# Altium schematic sheet TC364_MainBoard_Singal_V1.0.SchDoc
size A4
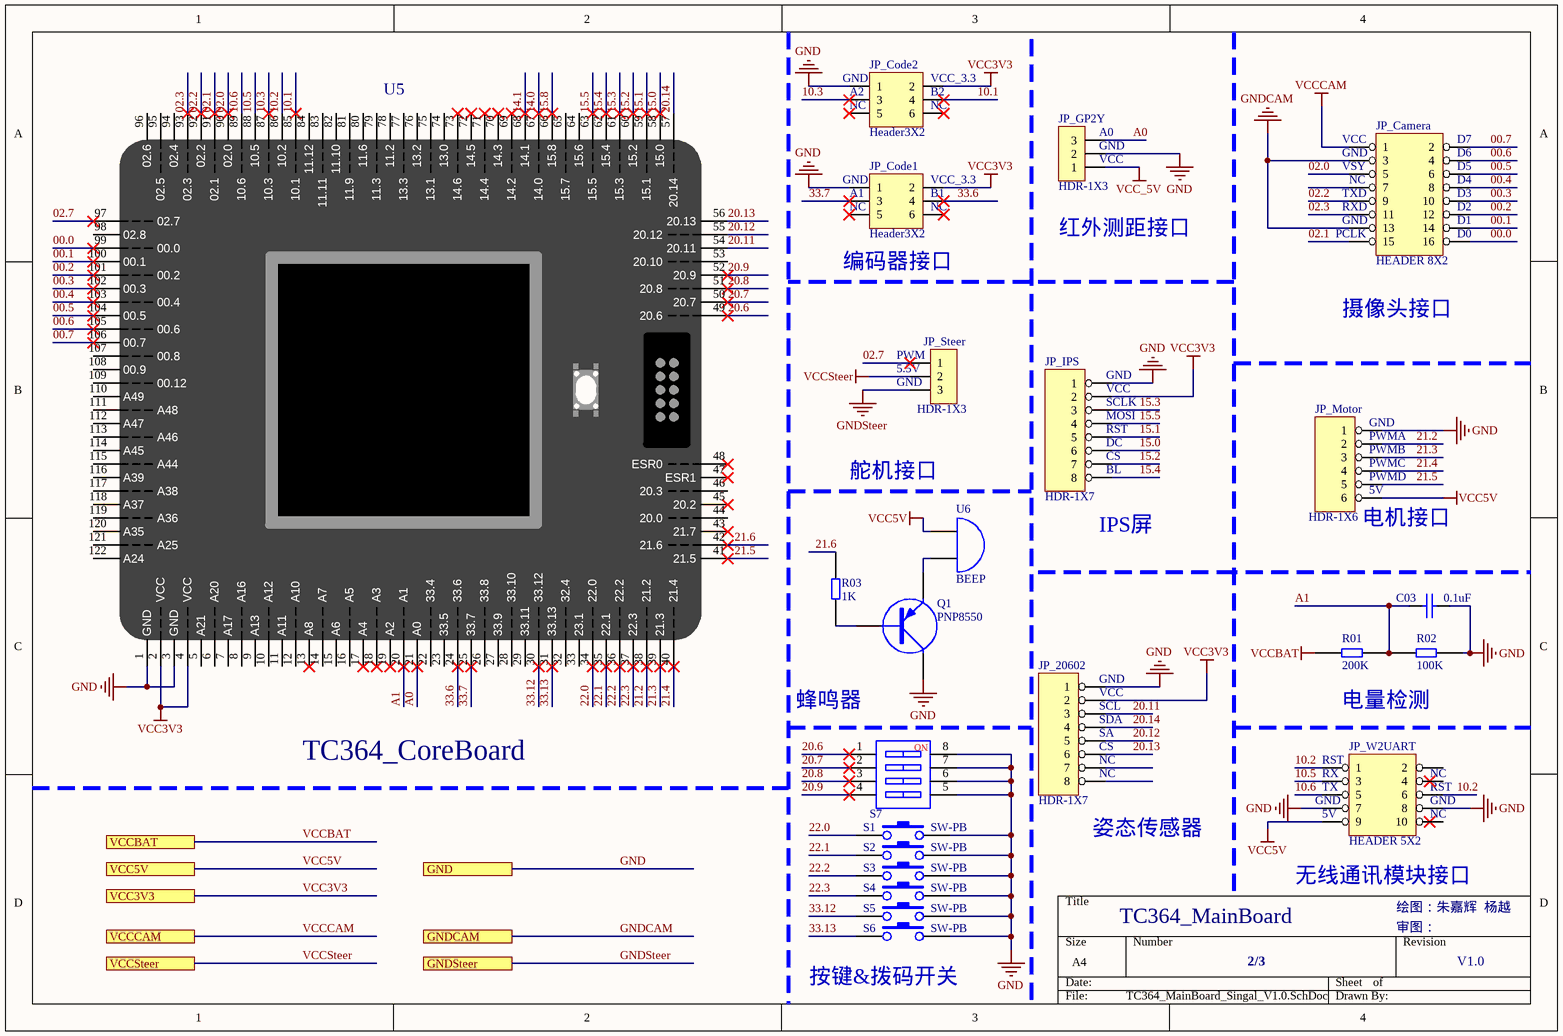
[diagram p0: TC364_MainBoard_Singal_V1.0.SchDoc]

## Parts
C03  0.1uF  [0805_C]
JP_20602  HDR-1X7  [SIP8]
JP_Camera  HEADER 8X2  [IDC16-JLC - duplicate]
JP_Code1  Header3X2  [HDR2.54-LI-2x3P]
JP_Code2  Header3X2  [HDR2.54-LI-2x3P]
JP_GP2Y  HDR-1X3  [HDR2.54-LI-3P]
JP_IPS  HDR-1X7  [SIP8]
JP_Motor  HDR-1X6  [SIP6N]
JP_Steer  HDR-1X3  [HDR2.54-LI-3P]
JP_W2UART  HEADER 5X2  [IDC10-JLC]
Q1  PNP8550  [PNP8550-SO]
R01  200K  [0805_R]
R02  100K  [0805_R]
R03  1K  [0805_R]
S1  SW-PB  [KEY2-6X3]
S2  SW-PB  [KEY2-6X3]
S3  SW-PB  [KEY2-6X3]
S4  SW-PB  [KEY2-6X3]
S5  SW-PB  [KEY2-6X3]
S6  SW-PB  [KEY2-6X3]
S7  SW-4P  [CSW DIP-4P]  (value not drawn)
U5  TC364_CoreBoard  [TC364_CoreBoard]
U6  BEEP  [BUZ]

## Ports
GND, GNDCAM, GNDSteer, VCC3V3, VCC5V, VCCBAT, VCCCAM, VCCSteer

## Nets
GND: C03.2 JP_20602.1 JP_Code1.1 JP_Code2.1 JP_GP2Y.2 JP_IPS.1 JP_Motor.1 JP_W2UART.7 JP_W2UART.8 Q1.3(C) R02.1 S1.2 S2.2 S3.2 S4.2 S5.2 S6.2 S7.5 S7.6 S7.7 S7.8 U5.1(GND) U5.3(GND) ; port GND
GNDCAM: JP_Camera.3 JP_Camera.13 ; port GNDCAM
GNDSteer: JP_Steer.3 ; port GNDSteer
VCC3V3: JP_20602.2 JP_Code1.2 JP_Code2.2 JP_IPS.2 U5.2(VCC) U5.4(VCC) ; port VCC3V3
VCC5V: JP_Motor.6 JP_W2UART.9 U6.1(A) ; port VCC5V
VCC_5V: JP_GP2Y.1
VCCBAT: R01.2 ; port VCCBAT
VCCCAM: JP_Camera.1 ; port VCCCAM
VCCSteer: JP_Steer.2 ; port VCCSteer
00.0: JP_Camera.16 U5.99(00.0)
00.1: JP_Camera.14 U5.100(00.1)
00.2: JP_Camera.12 U5.101(00.2)
00.3: JP_Camera.10 U5.102(00.3)
00.4: JP_Camera.8 U5.103(00.4)
00.5: JP_Camera.6 U5.104(00.5)
00.6: JP_Camera.4 U5.105(00.6)
00.7: JP_Camera.2 U5.106(00.7)
02.0: JP_Camera.5 U5.90(02.0)
02.1: JP_Camera.15 U5.91(02.1)
02.2: JP_Camera.9 U5.92(02.2)
02.3: JP_Camera.11 U5.93(02.3)
02.7: JP_Steer.1 U5.97(02.7)
10.1: JP_Code2.4 U5.85(10.1)
10.2: JP_W2UART.1 JP_W2UART.6 U5.86(10.2)
10.3: JP_Code2.3 U5.87(10.3)
10.5: JP_W2UART.3 U5.88(10.5)
10.6: JP_W2UART.5 U5.89(10.6)
14.0: U5.67(14.0)
14.1: U5.68(14.1)
15.0: JP_IPS.6 U5.58(15.0)
15.1: JP_IPS.5 U5.59(15.1)
15.2: JP_IPS.7 U5.60(15.2)
15.3: JP_IPS.3 U5.61(15.3)
15.4: JP_IPS.8 U5.62(15.4)
15.5: JP_IPS.4 U5.63(15.5)
15.8: U5.66(15.8)
20.6: S7.1 U5.49(20.6)
20.7: S7.2 U5.50(20.7)
20.8: S7.3 U5.51(20.8)
20.9: S7.4 U5.52(20.9)
20.11: JP_20602.3 U5.54(20.11)
20.12: JP_20602.5 U5.55(20.12)
20.13: JP_20602.6 U5.56(20.13)
20.14: JP_20602.4 U5.57(20.14)
21.2: JP_Motor.2 U5.38(21.2)
21.3: JP_Motor.3 U5.39(21.3)
21.4: JP_Motor.4 U5.40(21.4)
21.5: JP_Motor.5 U5.41(21.5)
21.6: R03.1 U5.42(21.6)
22.0: S1.1 U5.34(22.0)
22.1: S2.1 U5.35(22.1)
22.2: S3.1 U5.36(22.2)
22.3: S4.1 U5.37(22.3)
33.6: JP_Code1.4 U5.24(33.6)
33.7: JP_Code1.3 U5.25(33.7)
33.12: S5.1 U5.30(33.12)
33.13: S6.1 U5.31(33.13)
A0: JP_GP2Y.3 U5.21(A0)
A1: C03.1 R01.1 R02.2 U5.20(A1)
NetQ1_1: Q1.1(B) R03.2
NetQ1_2: Q1.2(E) U6.2(B)

Not connected (* = marked no-connect by the designer): JP_20602 7 8; JP_Camera 7; JP_Code1 5* 6*; JP_Code2 5* 6*; JP_W2UART 2 4 10; U5 5(A21) 6(A20) 7(A17) 8(A16) 9(A13) 10(A12) 11(A11) 12(A10) 13(A8)* 14(A7) 15(A6) 16(A5) 17(A4)* 18(A3)* 19(A2)* 22(33.4) 23(33.5) 26(33.8) 27(33.9) 28(33.10) 29(33.11) 32(32.4) 33(23.1) 43(21.7)* 44(20.0) 45(20.2)* 46(20.3) 47(ESR1)* 48(ESR0)* 53(20.10) 64(15.6) 65(15.7) 69(14.2)* 70(14.3)* 71(14.4)* 72(14.5)* 73(14.6)* 74(13.0) 75(13.1) 76(13.2) 77(13.3) 78(11.2) 79(11.3) 80(11.6) 81(11.9) 82(11.10) 83(11.11) 84(11.12) 94(02.4) 95(02.5) 96(02.6) 98(02.8) 107(00.8) 108(00.9) 109(00.12) 110(A49) 111(A48) 112(A47) 113(A46) 114(A45) 115(A44) 116(A39) 117(A38) 118(A37) 119(A36) 120(A35) 121(A25) 122(A24)

## Notes on the sheet
- (near JP_Code2) GND
- (near JP_Code2) A2
- (near JP_Code2) NC
- (near JP_Code2) B2
- (near JP_Code2) VCC_3.3
- (near JP_GP2Y) A0
- (near JP_GP2Y) GND
- (near JP_GP2Y) VCC
- (near JP_Camera) GND
- (near JP_Camera) VSY
- (near JP_Camera) VCC
- (near JP_Camera) D5
- (near JP_Camera) D6
- (near JP_Camera) D7
- (near JP_Code1) GND
- (near JP_Code1) A1
- (near JP_Code1) NC
- (near JP_Code1) B1
- (near JP_Code1) VCC_3.3
- (near JP_GP2Y) 红外测距接口
- (near JP_Camera) PCLK
- (near JP_Camera) TXD
- (near JP_Camera) RXD
- (near JP_Camera) NC
- (near JP_Camera) D0
- (near JP_Camera) D1
- (near JP_Camera) D2
- (near JP_Camera) D3
- (near JP_Camera) D4
- (near JP_Code1) 编码器接口
- (near JP_Steer) PWM
- (near JP_Steer) GND
- (near JP_Steer) 5.5V
- (near JP_IPS) GND
- 摄像头接口
- (near JP_IPS) VCC
- (near JP_IPS) SCLK
- (near JP_IPS) MOSI
- (near JP_IPS) RST
- (near JP_IPS) DC
- (near JP_Motor) GND
- (near JP_Motor) PWMA
- 舵机接口
- (near JP_IPS) CS
- (near JP_IPS) BL
- (near JP_Motor) 5V
- (near JP_Motor) PWMB
- (near JP_Motor) PWMC
- (near JP_Motor) PWMD
- (near JP_IPS) IPS屏
- (near JP_Motor) 电机接口
- 蜂鸣器
- (near JP_20602) VCC
- (near JP_20602) SCL
- (near JP_20602) GND
- 电量检测
- (near JP_20602) SDA
- (near JP_20602) SA
- (near JP_20602) NC
- (near JP_20602) CS
- (near JP_W2UART) TX
- (near JP_W2UART) RX
- (near JP_W2UART) RST
- (near JP_W2UART) NC
- (near JP_20602) 姿态传感器
- (near JP_W2UART) GND
- (near JP_W2UART) 5V
- TC364_MainBoard
- (near JP_W2UART) 无线通讯模块接口
- 绘图：朱嘉辉  杨越
- (near S6) 按键&拨码开关
- 2/3
- 审图：
- V1.0
- (in symbol SW-4P) NO

## Library data of the parts
C03 = CAP: Capacitor
JP_20602 JP_IPS = HEADER 8: 8 Pin Header
JP_Code1 JP_Code2 = Header 3X2: 3*2P接插件; 版权归属: 封装库来自淘宝 ID：黄晶宝石; BOM名称: 3*2P接插件; 学习资源: https://shop463601444.taobao.com
JP_GP2Y JP_Steer = Header 3: 3P接插件; 版权归属: 封装库来自淘宝 ID：黄晶宝石; BOM名称: 3P接插件; 学习资源: https://shop463601444.taobao.com
JP_Motor = HEADER 6
Q1 = PNP: PNP Transistor
R01 R02 R03 = RES
S1-S6 = SW-PB: 按键
S7 = SW-4P: 4路编码开关; 淘宝ID: 封装库来自淘宝 ID：黄晶宝石; BOM名称: 4路编码开关; 学习资源: https://shop463601444.taobao.com
U5 = TC264_CoreBoard: 逐飞科技TC264核心板
U6 = BELL